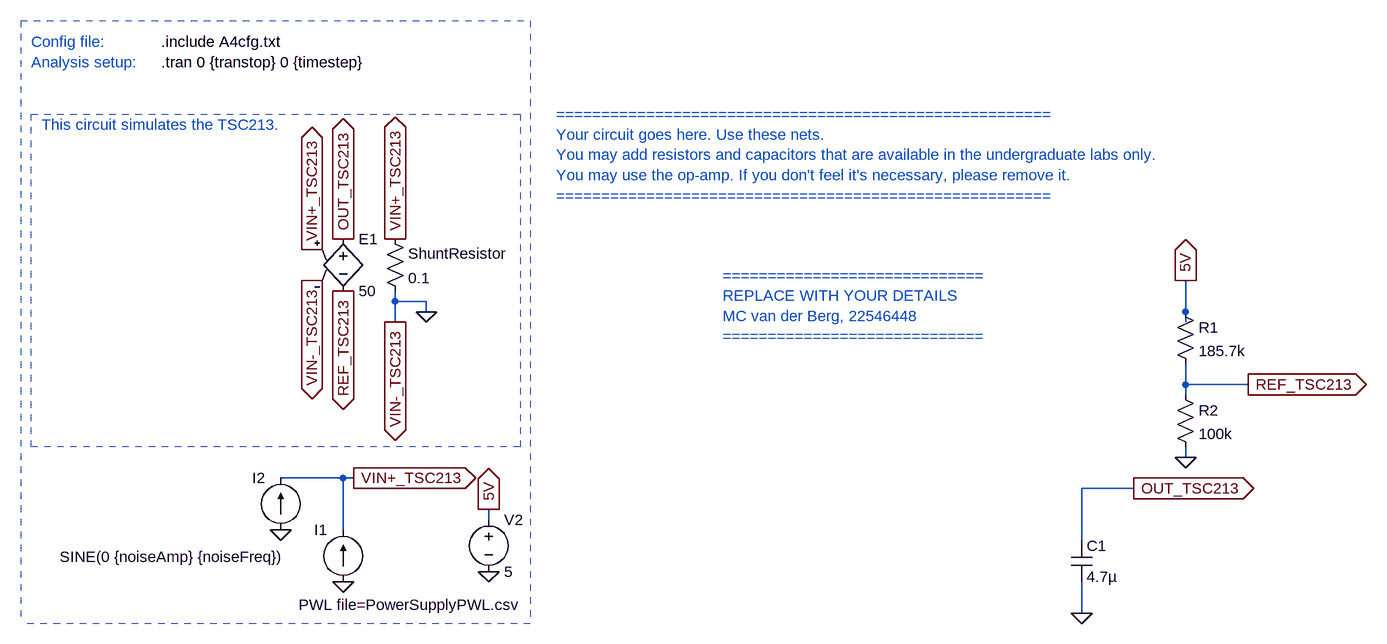
[diagram p0: schematic E344_22546448_A4.asc]
E344_22546448_A4.asc, the LTspice schematic file:
Version 4
SHEET 1 1824 680
WIRE -1792 -992 -1792 -1008
WIRE -1744 -992 -1792 -992
WIRE -1744 -976 -1744 -992
WIRE -576 -976 -576 -1024
WIRE -1792 -960 -1792 -992
WIRE -576 -960 -576 -976
WIRE -576 -864 -576 -896
WIRE -480 -864 -576 -864
WIRE -576 -848 -576 -864
WIRE -576 -752 -576 -768
WIRE -1872 -720 -1968 -720
WIRE -1856 -720 -1872 -720
WIRE -656 -704 -736 -704
WIRE -1648 -656 -1648 -672
WIRE -1872 -640 -1872 -720
WIRE -736 -624 -736 -704
WIRE -736 -512 -736 -560
FLAG -1648 -672 5V
IOPIN -1648 -672 Out
FLAG -1648 -576 0
FLAG -656 -704 OUT_TSC213
IOPIN -656 -704 Out
FLAG -1872 -560 0
FLAG -1792 -1088 VIN+_TSC213
IOPIN -1792 -1088 Out
FLAG -1792 -960 VIN-_TSC213
IOPIN -1792 -960 Out
FLAG -1920 -1024 VIN-_TSC213
IOPIN -1920 -1024 Out
FLAG -1920 -1072 VIN+_TSC213
IOPIN -1920 -1072 Out
FLAG -1872 -1008 REF_TSC213
IOPIN -1872 -1008 Out
FLAG -1872 -1088 OUT_TSC213
IOPIN -1872 -1088 Out
FLAG -1856 -720 VIN+_TSC213
IOPIN -1856 -720 Out
FLAG -1968 -640 0
FLAG -576 -1024 5V
IOPIN -576 -1024 Out
FLAG -1744 -976 0
FLAG -480 -864 REF_TSC213
IOPIN -480 -864 Out
FLAG -576 -752 0
FLAG -736 -512 0
SYMBOL e -1872 -1104 R0
SYMATTR InstName E1
SYMATTR Value 50
SYMBOL current -1872 -560 R180
WINDOW 0 24 80 Left 2
WINDOW 3 -271 -35 Left 2
WINDOW 123 0 0 Left 0
WINDOW 39 0 0 Left 0
SYMATTR InstName I1
SYMATTR Value PWL file=PowerSupplyPWL.csv
SYMBOL res -1808 -1104 R0
WINDOW 0 36 38 Left 2
SYMATTR InstName ShuntResistor
SYMATTR Value 0.1
SYMBOL voltage -1648 -672 R0
WINDOW 123 0 0 Left 0
WINDOW 39 0 0 Left 0
SYMATTR InstName V2
SYMATTR Value 5
SYMBOL current -1968 -640 R180
WINDOW 0 24 80 Left 2
WINDOW 3 -7 -41 Left 2
WINDOW 123 0 0 Left 0
WINDOW 39 0 0 Left 0
SYMATTR InstName I2
SYMATTR Value SINE(0 {noiseAmp} {noiseFreq})
SYMBOL cap -752 -624 R0
SYMATTR InstName C1
SYMATTR Value 4.7µ
SYMBOL res -592 -992 R0
SYMATTR InstName R1
SYMATTR Value 185.7k
SYMBOL res -592 -864 R0
SYMATTR InstName R2
SYMATTR Value 100k
TEXT -2152 -1360 Left 2 !.tran 0 {transtop} 0 {timestep}
TEXT -2152 -1392 Left 2 !.include A4cfg.txt
TEXT -2352 -1392 Left 2 ;Config file:
TEXT -2352 -1360 Left 2 ;Analysis setup:
TEXT -1288 -1032 Left 2 ;=============================\nREPLACE WITH YOUR DETAILS\nMC van der Berg, 22546448\n=============================
TEXT -1544 -1280 Left 2 ;=======================================================\nYour circuit goes here. Use these nets.\nYou may add resistors and capacitors that are available in the undergraduate labs only.\nYou may use the op-amp. If you don't feel it's necessary, please remove it.\n=======================================================
TEXT -2336 -1264 Left 2 ;This circuit simulates the TSC213.
LINE Normal -1584 -1424 -1584 -496 2
LINE Normal -2368 -1424 -1584 -1424 2
LINE Normal -1584 -496 -2368 -496 2
LINE Normal -1584 -512 -1584 -512 2
LINE Normal -2368 -1424 -2368 -496 2
RECTANGLE Normal -2352 -1280 -1600 -768 2

The netlist it stands for:
* E344_22546448_A4.asc
E1 OUT_TSC213 REF_TSC213 VIN+_TSC213 0 50
I1 0 VIN+_TSC213 PWL file=PowerSupplyPWL.csv
R§ShuntResistor VIN+_TSC213 0 0.1
V2 5V 0 5
I2 0 VIN+_TSC213 SINE(0 {noiseAmp} {noiseFreq})
C1 OUT_TSC213 0 4.7µ
R1 5V REF_TSC213 185.7k
R2 REF_TSC213 0 100k
.tran 0 {transtop} 0 {timestep}
.include A4cfg.txt
* Config file:
* Analysis setup:
* =============================
* REPLACE WITH YOUR DETAILS
* MC van der Berg, 22546448
* =============================
* =======================================================
* Your circuit goes here. Use these nets.
* You may add resistors and capacitors that are available in the undergraduate labs only.
* You may use the op-amp. If you don't feel it's necessary, please remove it.
* =======================================================
* This circuit simulates the TSC213.
.backanno
.end

* Results of the author's LTspice run, read from the files saved beside the schematic
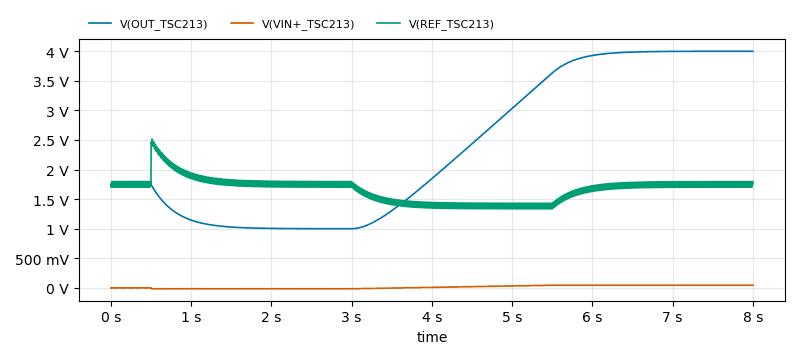
[diagram p1: Transient Analysis of E344_22546448_A4.asc, plotted from the saved traces]
* Transient Analysis, 1 run:
*   V(OUT_TSC213): min 999.8 mV, max 4.001 V, average 2.367 V, rms 2.674 V, last 3.999 V
*   V(VIN+_TSC213): min -16 mV, max 46 mV, average 14.06 mV, rms 29.46 mV, last 45 mV
*   V(REF_TSC213): min 1.334 V, max 2.516 V, average 1.664 V, rms 1.677 V, last 1.749 V